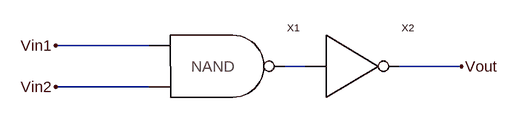
[diagram p0: schematic AND_2.asc]
AND_2.asc, the LTspice schematic file:
Version 4
SHEET 1 880 680
WIRE 160 128 16 128
WIRE 400 160 368 160
WIRE 640 160 544 160
WIRE 160 192 16 192
FLAG 16 128 Vin1
FLAG 16 192 Vin2
FLAG 640 160 Vout
SYMBOL inverter 432 160 R0
SYMATTR InstName X2
SYMBOL NAND_2 192 160 R0
SYMATTR InstName X1

The netlist it stands for:
* AND_2.asc
XX2 N001 Vout inverter  ; pins Vin Vout
XX1 Vin1 Vin2 N001 NAND_2  ; pins Vin1 Vin2 Vout
.backanno
.end